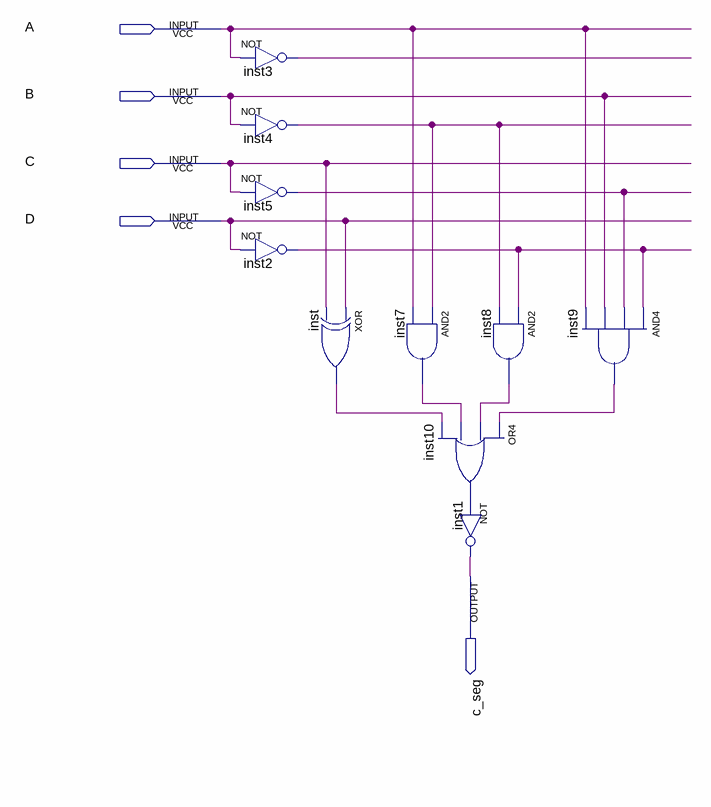
[diagram p0: schematic sheet]
// Quartus schematic clight.bdf as structural Verilog: 10 symbols, 5 pins
module clight (
  input  A,
  input  B,
  input  C,
  input  D,
  output c_seg
);

  wire inst2_out, inst3_out, inst4_out, inst5_out, inst7_out, inst8_out, inst9_out, inst10_out, inst_out;

  not inst3 (inst3_out, A);
  not inst4 (inst4_out, B);
  not inst5 (inst5_out, C);
  not inst2 (inst2_out, D);
  xor inst (inst_out, D, C);
  and inst7 (inst7_out, inst4_out, A);
  or inst10 (inst10_out, inst9_out, inst8_out, inst7_out, inst_out);
  not inst1 (c_seg, inst10_out);
  and inst8 (inst8_out, inst2_out, inst4_out);
  and inst9 (inst9_out, inst2_out, inst5_out, B, A);
endmodule
